# EAGLE design leddriversmall (EAGLE 6.1)
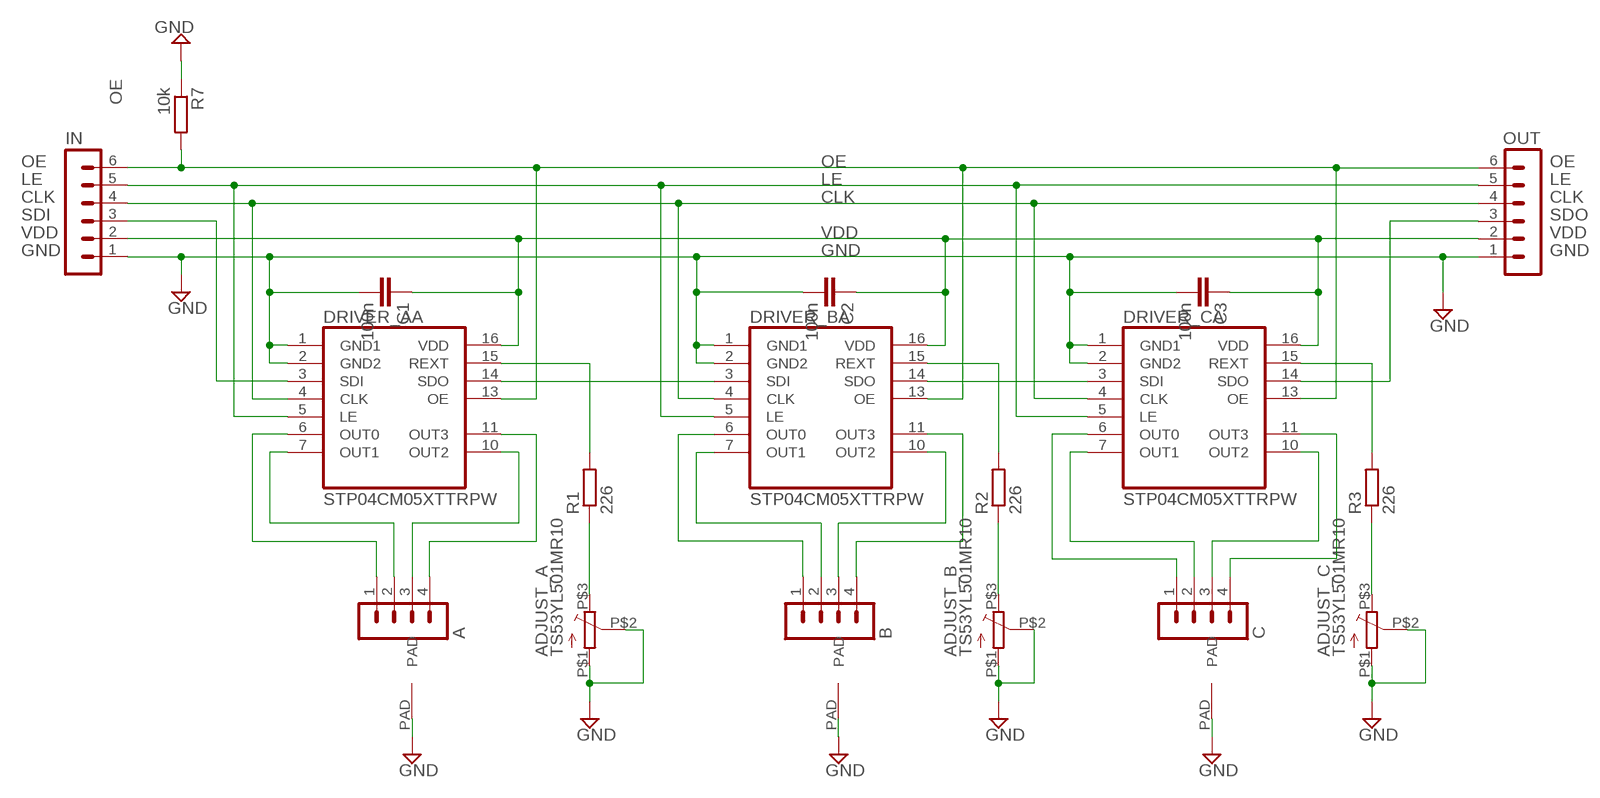
[diagram p0: schematic, sheet 1]

## Parts
A  MA04-1  [MA04-1]
ADJUST_A  TS53YL501MR10  [TS53Y]
ADJUST_B  TS53YL501MR10  [TS53Y]
ADJUST_C  TS53YL501MR10  [TS53Y]
B  MA04-1  [MA04-1]
C  MA04-1  [MA04-1]
C1  100n  C-EUC0805  [C0805]
C2  100n  C-EUC0805  [C0805]
C3  100n  C-EUC0805  [C0805]
DRIVER_A  STP04CM05XTTRPW  [HTSSOP16]
DRIVER_B  STP04CM05XTTRPW  [HTSSOP16]
DRIVER_C  STP04CM05XTTRPW  [HTSSOP16]
IN  MA06-1  [MA06-1]
OUT  MA06-1  [MA06-1]
R1  226  R-EU_R0805  [R0805]
R2  226  R-EU_R0805  [R0805]
R3  226  R-EU_R0805  [R0805]
R7  10k  R-EU_R0805  [R0805]

## Nets
CLK: DRIVER_A.4(A:CLK) DRIVER_B.4(A:CLK) DRIVER_C.4(A:CLK) IN.4 OUT.4
GND: ADJUST_A.P$1(A) ADJUST_A.P$2(B) ADJUST_B.P$1(A) ADJUST_B.P$2(B) ADJUST_C.P$1(A) ADJUST_C.P$2(B) C1.2 C2.2 C3.2 DRIVER_A.1(A:GND1) DRIVER_A.2(A:GND2) DRIVER_A.PAD(PAD:PAD) DRIVER_B.1(A:GND1) DRIVER_B.2(A:GND2) DRIVER_B.PAD(PAD:PAD) DRIVER_C.1(A:GND1) DRIVER_C.2(A:GND2) DRIVER_C.PAD(PAD:PAD) IN.1 OUT.1 R7.1
LE: DRIVER_A.5(A:LE) DRIVER_B.5(A:LE) DRIVER_C.5(A:LE) IN.5 OUT.5
N$1: DRIVER_A.14(A:SDO) DRIVER_B.3(A:SDI)
N$2: DRIVER_B.14(A:SDO) DRIVER_C.3(A:SDI)
N$3: ADJUST_A.P$3(C) R1.1
N$4: ADJUST_B.P$3(C) R2.1
N$6: ADJUST_C.P$3(C) R3.1
N$7: A.4 DRIVER_A.11(A:OUT3)
N$8: B.1 DRIVER_B.6(A:OUT0)
N$9: A.1 DRIVER_A.6(A:OUT0)
N$11: C.2 DRIVER_C.7(A:OUT1)
N$12: A.3 DRIVER_A.10(A:OUT2)
N$13: B.2 DRIVER_B.7(A:OUT1)
N$16: A.2 DRIVER_A.7(A:OUT1)
N$18: C.3 DRIVER_C.10(A:OUT2)
N$19: C.4 DRIVER_C.11(A:OUT3)
N$27: C.1 DRIVER_C.6(A:OUT0)
N$28: B.3 DRIVER_B.10(A:OUT2)
N$29: DRIVER_A.15(A:REXT) R1.2
N$31: B.4 DRIVER_B.11(A:OUT3)
N$33: DRIVER_B.15(A:REXT) R2.2
OE: DRIVER_A.13(A:OE) DRIVER_B.13(A:OE) DRIVER_C.13(A:OE) IN.6 OUT.6 R7.2
REXT: DRIVER_C.15(A:REXT) R3.2
SDI: DRIVER_A.3(A:SDI) IN.3
SDO: DRIVER_C.14(A:SDO) OUT.3
VDD: C1.1 C2.1 C3.1 DRIVER_A.16(A:VDD) DRIVER_B.16(A:VDD) DRIVER_C.16(A:VDD) IN.2 OUT.2

## Library data of the parts
A B C = con-lstb:MA04-1: PIN HEADER; OC_FARNELL: unknown; OC_NEWARK: unknown
ADJUST_A ADJUST_B ADJUST_C = elcojacobs:TS53YL501MR10
C1-C3 = rcl:C-EU: CAPACITOR, European symbol
DRIVER_A DRIVER_B DRIVER_C = STP04CM05:STP04CM05XTTR: 4bit constant current LED driver
IN OUT = con-lstb:MA06-1: PIN HEADER; OC_FARNELL: unknown; OC_NEWARK: unknown
R1-R3 R7 = rcl:R-EU_: RESISTOR, European symbol

## Board
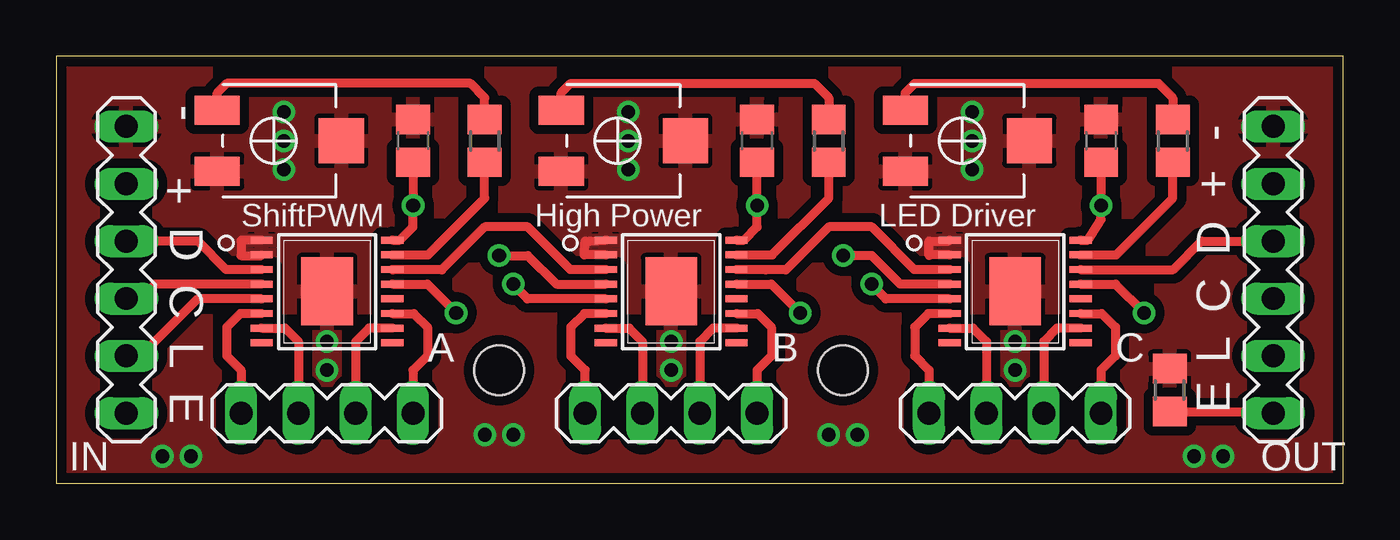
[diagram p1: board, top side]
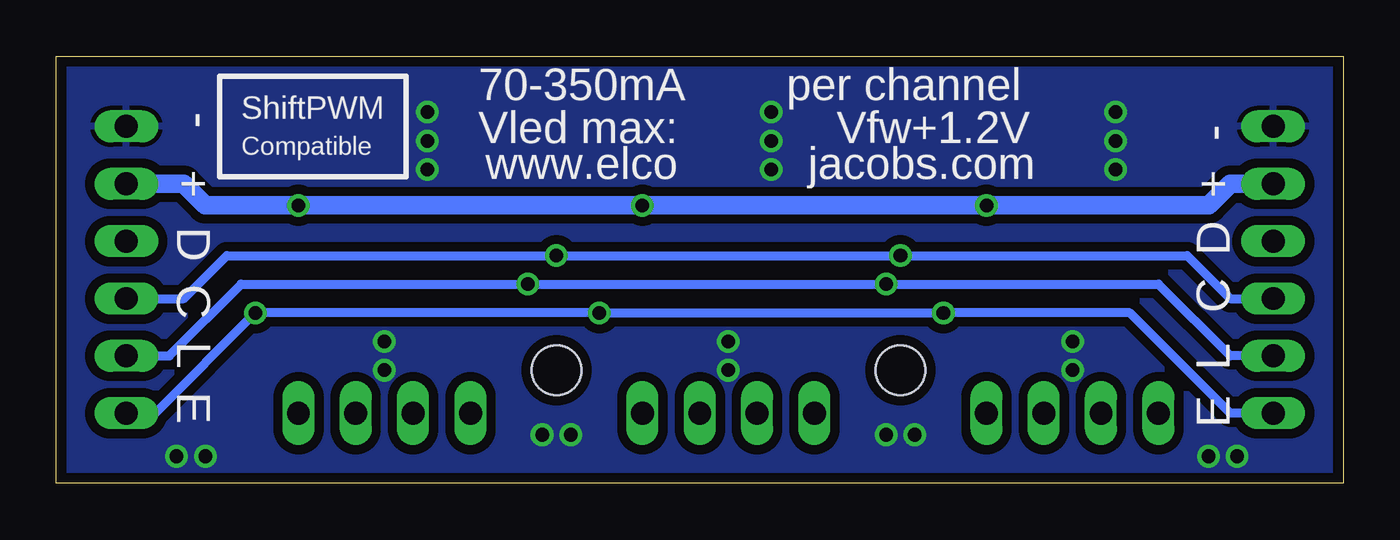
[diagram p2: board, bottom side, seen from below]

Size 57 x 18.9 mm. Coordinates in mm from the lower left corner, seen from the top.
Outline: 0,0 57,0 57,18.9 0,18.9 0,0
Copper layers (1*16): Top 0.018mm / dielectric 1.55mm / Bottom 0.018mm
Design rules: minimum track width 0.15mm, minimum drill 0.25mm, track to track 0.15mm, track to pad 0.15mm, pad to pad 0.15mm, via to via 0.15mm, smd to smd 0.15mm, copper to edge 0.45mm, drill to drill 0.3mm, minimum pad ring 0.2mm, minimum via ring 0.2mm, stop-mask expansion 0.1mm, vias tented up to drill 0mil, thermal gap 0.2mm
Holes 2.2 mm at 19.61,5 34.85,5

### Footprints (pad centres in the part's own frame; a part is rotated, then mirrored left to right if it is on the bottom)
MA04-1 = drill 1.016 long: 1 -3.81,0; 2 -1.27,0; 3 1.27,0; 4 3.81,0
TS53Y = smd 1.3 x 2: P$1 -1.35,5.5; P$3 1.35,5.5 | smd 2 x 2: P$2 0,0
C0805 = smd 1.3 x 1.5: 1 -0.95,0; 2 0.95,0
HTSSOP16 = smd 0.305 x 0.991: 1 -1.95,-2.9; 2 -1.3,-2.9; 3 -0.65,-2.9; 4 0,-2.9; 5 0.65,-2.9; 6 1.3,-2.9; 7 1.95,-2.9; 8 2.6,-2.9; 9 2.6,2.9; 10 1.95,2.9; 11 1.3,2.9; 12 0.65,2.9; 13 0,2.9; 14 -0.65,2.9; 15 -1.3,2.9; 16 -1.95,2.9 | smd 3 x 2.286: PAD 0.31,0
MA06-1 = drill 1.016 long: 1 -6.35,0; 2 -3.81,0; 3 -1.27,0; 4 1.27,0; 5 3.81,0; 6 6.35,0
R0805 = smd 1.3 x 1.5: 1 -0.95,0; 2 0.95,0

### Placement (x,y rotation side)
A  11.99,3.1 0 top
ADJUST_A  12.62,15.16 90 top
ADJUST_B  27.86,15.16 90 top
ADJUST_C  43.1,15.16 90 top
B  27.23,3.1 0 top
C  42.47,3.1 0 top
C1  15.8,15.16 90 top
C2  31.04,15.16 90 top
C3  46.28,15.16 90 top
DRIVER_A  11.99,8.82 270 top
DRIVER_B  27.23,8.82 270 top
DRIVER_C  42.47,8.82 270 top
IN  3.1,9.45 270 top
OUT  53.9,9.45 270 top
R1  18.97,15.16 270 top
R2  34.21,15.16 270 top
R3  49.45,15.16 270 top
R7  49.32,4.12 270 top

### Tracks (layer width: path | path; a pad name or v marks a point on that pad's centre or on a via)
CLK  (via drill 0.6)
  Top 0.406: DRIVER_C.4 37.39,8.82 36.12,10.09 v34.85,10.09 | v19.61,10.09 20.88,10.09 22.15,8.82 DRIVER_B.4 | IN.4 3.74,8.18 4.37,8.82 DRIVER_A.4
  Bottom 0.406: OUT.4 51.36,8.18 49.45,10.09 v34.85,10.09 v19.61,10.09 6.91,10.09 5,8.18 IN.4
GND  (via drill 0.6)
  Top 0.406: DRIVER_B.2 23.39,10.11 23.42,10.72 23.65,10.72 DRIVER_B.1 | DRIVER_A.1 8.23,10.77 8.18,10.72 8.18,10.09 9.06,10.09 DRIVER_A.2 | DRIVER_C.2 38.69,10.11 38.66,10.09 38.66,10.72 39.52,10.72 DRIVER_C.1
  other vias: 11.99,5 20.24,2.15 18.97,2.15 27.23,6.28 35.48,2.15 34.21,2.15 10.09,13.89 10.09,15.16 10.09,16.43 25.32,16.43 25.32,15.16 25.32,13.89 40.56,16.43 40.56,15.16 40.56,13.89 42.47,6.28 51.68,1.2 5.96,1.2 4.69,1.2 50.41,1.2 11.99,6.28 27.23,5 42.47,5
  pour Bottom (isolate 0.406): 0,18.9 0,0 57,0 57,18.9
  pour Top (isolate 0.406): 0,0 0,18.9 57,18.9 57,0
LE  (via drill 0.6)
  Top 0.406: DRIVER_B.5 20.86,8.16 v20.24,8.82 | DRIVER_C.5 36.74,8.16 v36.12,8.82 | DRIVER_A.5 6.26,8.16 3.74,5.64 IN.5
  Bottom 0.406: OUT.5 51.99,5.64 48.82,8.82 v36.12,8.82 v20.24,8.82 8.18,8.82 5,5.64 IN.5
N$1
  Top 0.406: DRIVER_B.3 22.77,9.46 20.88,11.36 18.97,11.36 17.07,9.45 14.91,9.45 DRIVER_A.14
N$2
  Top 0.406: DRIVER_C.3 38.01,9.46 36.12,11.36 34.21,11.36 32.31,9.45 31.41,9.45 DRIVER_B.14
N$3
  Top 0.406: R1.1 18.97,17.07 18.34,17.7 7.55,17.7 7.12,17.29 ADJUST_A.P$3
N$4
  Top 0.406: ADJUST_B.P$3 22.36,17.29 22.79,17.7 33.58,17.7 34.21,17.07 R2.1
N$6
  Top 0.406: ADJUST_C.P$3 37.6,17.29 38.02,17.7 48.82,17.7 49.45,17.07 R3.1
N$7
  Top 0.406: DRIVER_A.11 15.83,7.51 16.43,6.91 16.43,5.64 15.8,5 A.4
N$8
  Top 0.406: B.1 23.42,5 22.79,5.64 22.79,6.91 23.39,7.51 DRIVER_B.6
N$9
  Top 0.406: DRIVER_A.6 8.15,7.51 7.55,6.91 7.55,5.64 8.18,5 A.1
N$11
  Top 0.406: DRIVER_C.7 40.61,6.87 41.2,6.28 C.2
N$12
  Top 0.406: DRIVER_A.10 13.85,6.87 13.26,6.28 A.3
N$13
  Top 0.406: DRIVER_B.7 25.37,6.87 25.96,6.28 B.2
N$16
  Top 0.406: DRIVER_A.7 10.13,6.87 10.72,6.28 A.2
N$18
  Top 0.406: DRIVER_C.10 44.33,6.87 43.74,6.28 C.3
N$19
  Top 0.406: DRIVER_C.11 46.31,7.51 46.91,6.91 46.91,5.64 46.28,5 C.4
N$27
  Top 0.406: DRIVER_C.6 38.63,7.51 38.02,6.91 38.02,5.64 38.66,5 C.1
N$28
  Top 0.406: DRIVER_B.10 29.09,6.87 28.5,6.28 B.3
N$29
  Top 0.406: 18.97,13.89 R1.2 18.97,12.62 16.46,10.11 DRIVER_A.15
N$31
  Top 0.406: DRIVER_B.11 31.07,7.51 31.67,6.91 31.67,5.64 31.04,5 B.4
N$33
  Top 0.406: DRIVER_B.15 31.7,10.11 34.21,12.62 R2.2
OE  (via drill 0.6)
  Top 0.406: DRIVER_A.13 16.43,8.82 v17.7,7.55 | DRIVER_B.13 31.67,8.82 v32.95,7.55 | DRIVER_C.13 46.91,8.82 v48.19,7.55 | R7.2 53.82,3.17 OUT.6
  Bottom 0.406: IN.6 5,3.1 9.45,7.55 v17.7,7.55 v32.95,7.55 v48.19,7.55 52.63,3.1 OUT.6
REXT
  Top 0.406: DRIVER_C.15 46.95,10.11 49.45,12.62 R3.2
SDI
  Top 0.406: DRIVER_A.3 7.53,9.46 6.28,10.72 IN.3
SDO
  Top 0.406: DRIVER_C.14 49.47,9.46 50.73,10.72 OUT.3
VDD  (via drill 0.6)
  Top 0.406: C1.1 v15.8,12.31 15.8,11.36 15.21,10.77 DRIVER_A.16 | DRIVER_B.16 30.45,10.77 31.04,11.36 v31.04,12.31 C2.1 | DRIVER_C.16 45.69,10.77 46.28,11.67 v46.28,12.31 C3.1
  Bottom 0.813: IN.2 5,13.26 5.96,12.31 v15.8,12.31 v31.04,12.31 v46.28,12.31 50.41,12.31 51.36,13.26 OUT.2

### Text on the board
tNames: - | - | + | + | D | ShiftPWM | High Power | LED Driver | D | C | C | L | L | E | E
bNames: per channel | 70-350mA | ShiftPWM | - | - | Vfw+1.2V | Vled max: | Compatible | + | jacobs.com | www.elco | + | D | D | C | C | L | L | E | E